# Altium schematic sheet RX_V1.SchDoc
size A; SheetNumber: 1; SheetTotal: 1
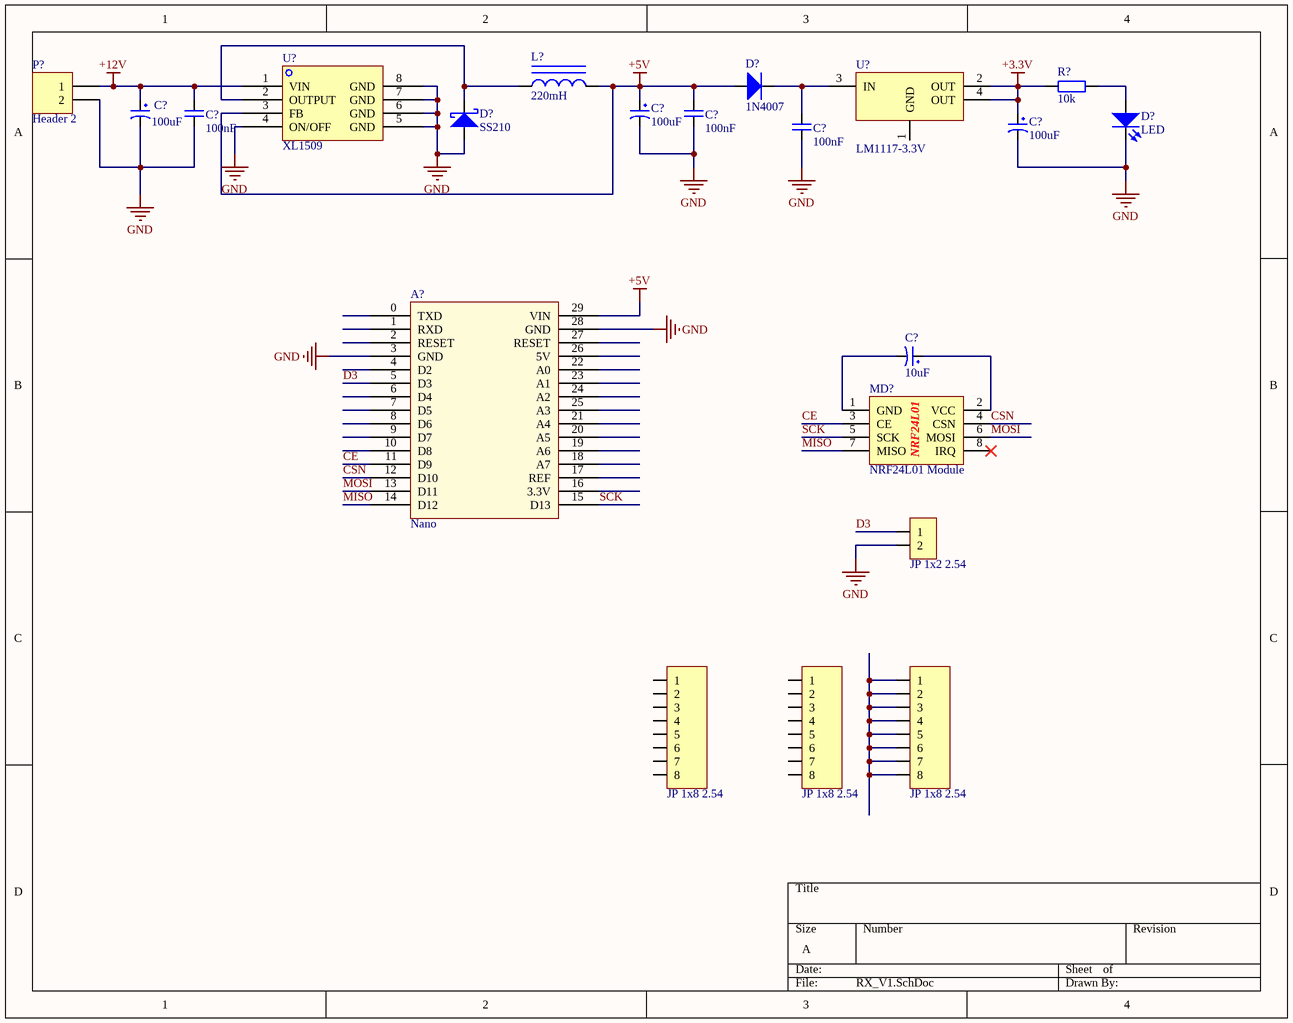
[diagram p0: RX_V1.SchDoc]

## Parts
(Parts that share a designator on the sheet are numbered #1, #2 ... from top to bottom, then left to right.)
A?  Nano  [Arduino nano]
C?#1  100uF  [tu hoa 5mm]
C?#2  100nF  [CN1]
C?#3  100uF  [tu hoa 5mm]
C?#4  100nF  [CN1]
C?#5  100nF  [CN1]
C?#6  100uF  [tu hoa 5mm]
C?#7  10uF  [tu hoa 5mm]
D?#1  1N4007  [DO-201AD-V]
D?#2  LED  [LED-3MM RED]
D?#3  SS210  [DO-214AC]
JP?#1  JP 1x2 2.54  [JP 1x2 DT]
JP?#2  JP 1x8 2.54  [JP 1x8 DT]
JP?#3  JP 1x8 2.54  [JP 1x8 DT]
JP?#4  JP 1x8 2.54  [JP 1x8 DT]
L?  220mH  [INDUCTOR SMD 7342 7.3X7.3X4.2mm]
MD?  NRF24L01 Module  [NRF24L01]
P?  Header 2  [HED2T]
R?  10k  [RESISTOR 1/4W]
U?#1  LM1117-3.3V  [SOT223-4N]
U?#2  XL1509  [SOP8]

## Nets
+3.3V: C?#6.1 R?.1 U?#1.2(OUT) U?#1.4(OUT)
+5V: A?.29(VIN) C?#3.1 C?#4.2 D?#1.1 L?.2 U?#2.3(FB)
+12V: C?#1.1 C?#2.2 P?.1 U?#2.1(VIN)
GND: A?.3(GND) A?.28(GND) C?#1.2 C?#2.1 C?#3.2 C?#4.1 C?#5.1 C?#6.2 D?#2.2 D?#3.1 JP?#1.2 P?.2 U?#2.4(ON/OFF) U?#2.5(GND) U?#2.6(GND) U?#2.7(GND) U?#2.8(GND)
CE: A?.11(D9) MD?.3(CE)
CSN: A?.12(D10) MD?.4(CSN)
D3: A?.5(D3) JP?#1.1
MISO: A?.14(D12) MD?.7(MISO)
MOSI: A?.13(D11) MD?.6(MOSI)
SCK: A?.15(D13) MD?.5(SCK)
NetC?#5_2: C?#5.2 D?#1.2 U?#1.3(IN)
NetC?#7_1: C?#7.1 MD?.2(VCC)
NetC?#7_2: C?#7.2 MD?.1(GND)
NetD?#2_1: D?#2.1 R?.2
NetD?#3_2: D?#3.2 L?.1 U?#2.2(OUTPUT)
NetJP?#4_1: JP?#4.1 JP?#4.2 JP?#4.3 JP?#4.4 JP?#4.5 JP?#4.6 JP?#4.7 JP?#4.8

Not connected (* = marked no-connect by the designer): A? 0(TXD) 1(RXD) 2(RESET) 4(D2) 6(D4) 7(D5) 8(D6) 9(D7) 10(D8) 16(3.3V) 17(REF) 18(A7) 19(A6) 20(A5) 21(A4) 22(A0) 23(A1) 24(A2) 25(A3) 26(5V) 27(RESET); JP?#2 1 2 3 4 5 6 7 8; JP?#3 1 2 3 4 5 6 7 8; MD? 8(IRQ)*; U?#1 1(GND)

## Notes on the sheet
- (in symbol NRF24L01 Module) NRF24L01

## Library data of the parts
A? = Arduino Nano
C?#1 C?#3 C?#6 C?#7 = Tu Hoa 100uF 25V 6x11: Cắm; Don_Vi: Con; So_Chan: 2; Ten_Linh_Kien: Tụ Hóa 100uF 25V 6x11MM; Ma_Hang: MH001351; Chung_Loai: Cắm; Kieu_Chan: *
C?#2 C?#4 C?#5 = Cap_Non-Polar
D?#1 = Diode Standard: Part Number: LED 3 ly Single Colour; Pricing: *
D?#2 = LED: LED Single; Value: LED 3 ly Single Colour
D?#3 = Diode Schottky: Part Number: LED 3 ly Single Colour; Pricing: *
JP?#1 = JP 1x2 2.54 Duc Thang: Cắm; Ten_Linh_Kien: Jump Đơn Đực 2.54MM 1x40P Thẳng 11MM; Don_Vi: Con; Ma_Hang: MH000903; Ghi_Chu: *; Kieu_Chan: *; Chung_Loai: Cắm
JP?#2-JP?#4 = JP 1x8 2.54 Duc Thang: Cắm; Ten_Linh_Kien: Jump Đơn Đực 2.54MM 1x40P Thẳng 11MM; Don_Vi: Con; Ma_Hang: MH000903; Ghi_Chu: *; Kieu_Chan: *; Chung_Loai: Cắm
L? = Inductor Iron: Magnetic-Core Inductor; Value: 150 mH
P? = Header 2: Header, 2-Pin; LatestRevisionDate: 17-Jul-2002; LatestRevisionNote: Re-released for DXP Platform.; Publisher: Altium Limited
R? = Resistor
U?#1 = LM1117: 800mA Low-Dropout Linear Regulator; Creator: Nguyen Ba Bien; Website: http://group3i.net
U?#2 = XL1509: IC power sop8